# Altium schematic sheet CanTransceiver.SchDoc
size A
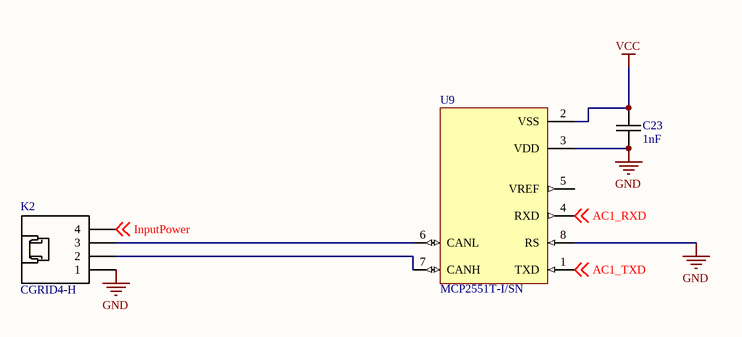
[diagram p0: CanTransceiver.SchDoc]

## Parts
C23  1nF  [0603C-GENERIC]
K2  CGRID4-H  [CGRID-4H]
U9  MCP2551T-I/SN  [SOIC-SN8_N]

## Nets
GND: C23.2 K2.1 U9.3(VDD) U9.8(RS)
VCC: C23.1 U9.2(VSS)
AC1_RXD: U9.4(RXD) ; off-sheet AC1_RXD
AC1_TXD: U9.1(TXD) ; off-sheet AC1_TXD
InputPower: K2.4 ; off-sheet InputPower
NetK2_2: K2.2 U9.7(CANH)
NetK2_3: K2.3 U9.6(CANL)

Not connected (* = marked no-connect by the designer): U9 5(VREF)

## Library data of the parts
C23 = 0603C-000: CAPACITOR 0603 CERAMIC
K2 = CGRID4-H: MOLEX GC/WALDOM CGRID CONNECTOR 4 PIN; Supplier 1: Digi-Key; Supplier Part Number 1: WM4902-ND
U9 = MCP2551T-I/SN: High-Speed CAN Transceiver, 8-Pin SOIC, Industrial Temperature, Tape and Reel; Published: 29-Jan-2009; DatasheetVersion: revE, Jan-2007; PackageVersion: revBB, Aug-2009; PackageReference: SOIC-SN8; Publisher: Altium Limited; PackageDescription: 8-Lead Plastic Small Outline (SN) - Narrow, 3.90mm Body [SOIC]; Supplier 1: Digi-Key; Supplier Part Number 1: MCP2551T-I/SNTR-ND; Supplier 2: Farnell; Supplier Part Number 2: 1788569; Code_JEDEC: MS-012; Code_IPC: SOIC127P600-8; ComponentLink1Description: Datasheet; ComponentLink1URL: http://ww1.microchip.com/downloads/en/DeviceDoc/21667E.pdf; ComponentLink2Description: Packaging Specification; ComponentLink2URL: http://www.microchip.com/stellent/groups/techpub_sg/documents/packagingspec/en012702.pdf; ComponentLink3Description: Microchip.com Home; ComponentLink3URL: http://www.microchip.com/